# Altium schematic sheet Sheet1.SchDoc
size A1; SheetNumber: 1; SheetTotal: 1
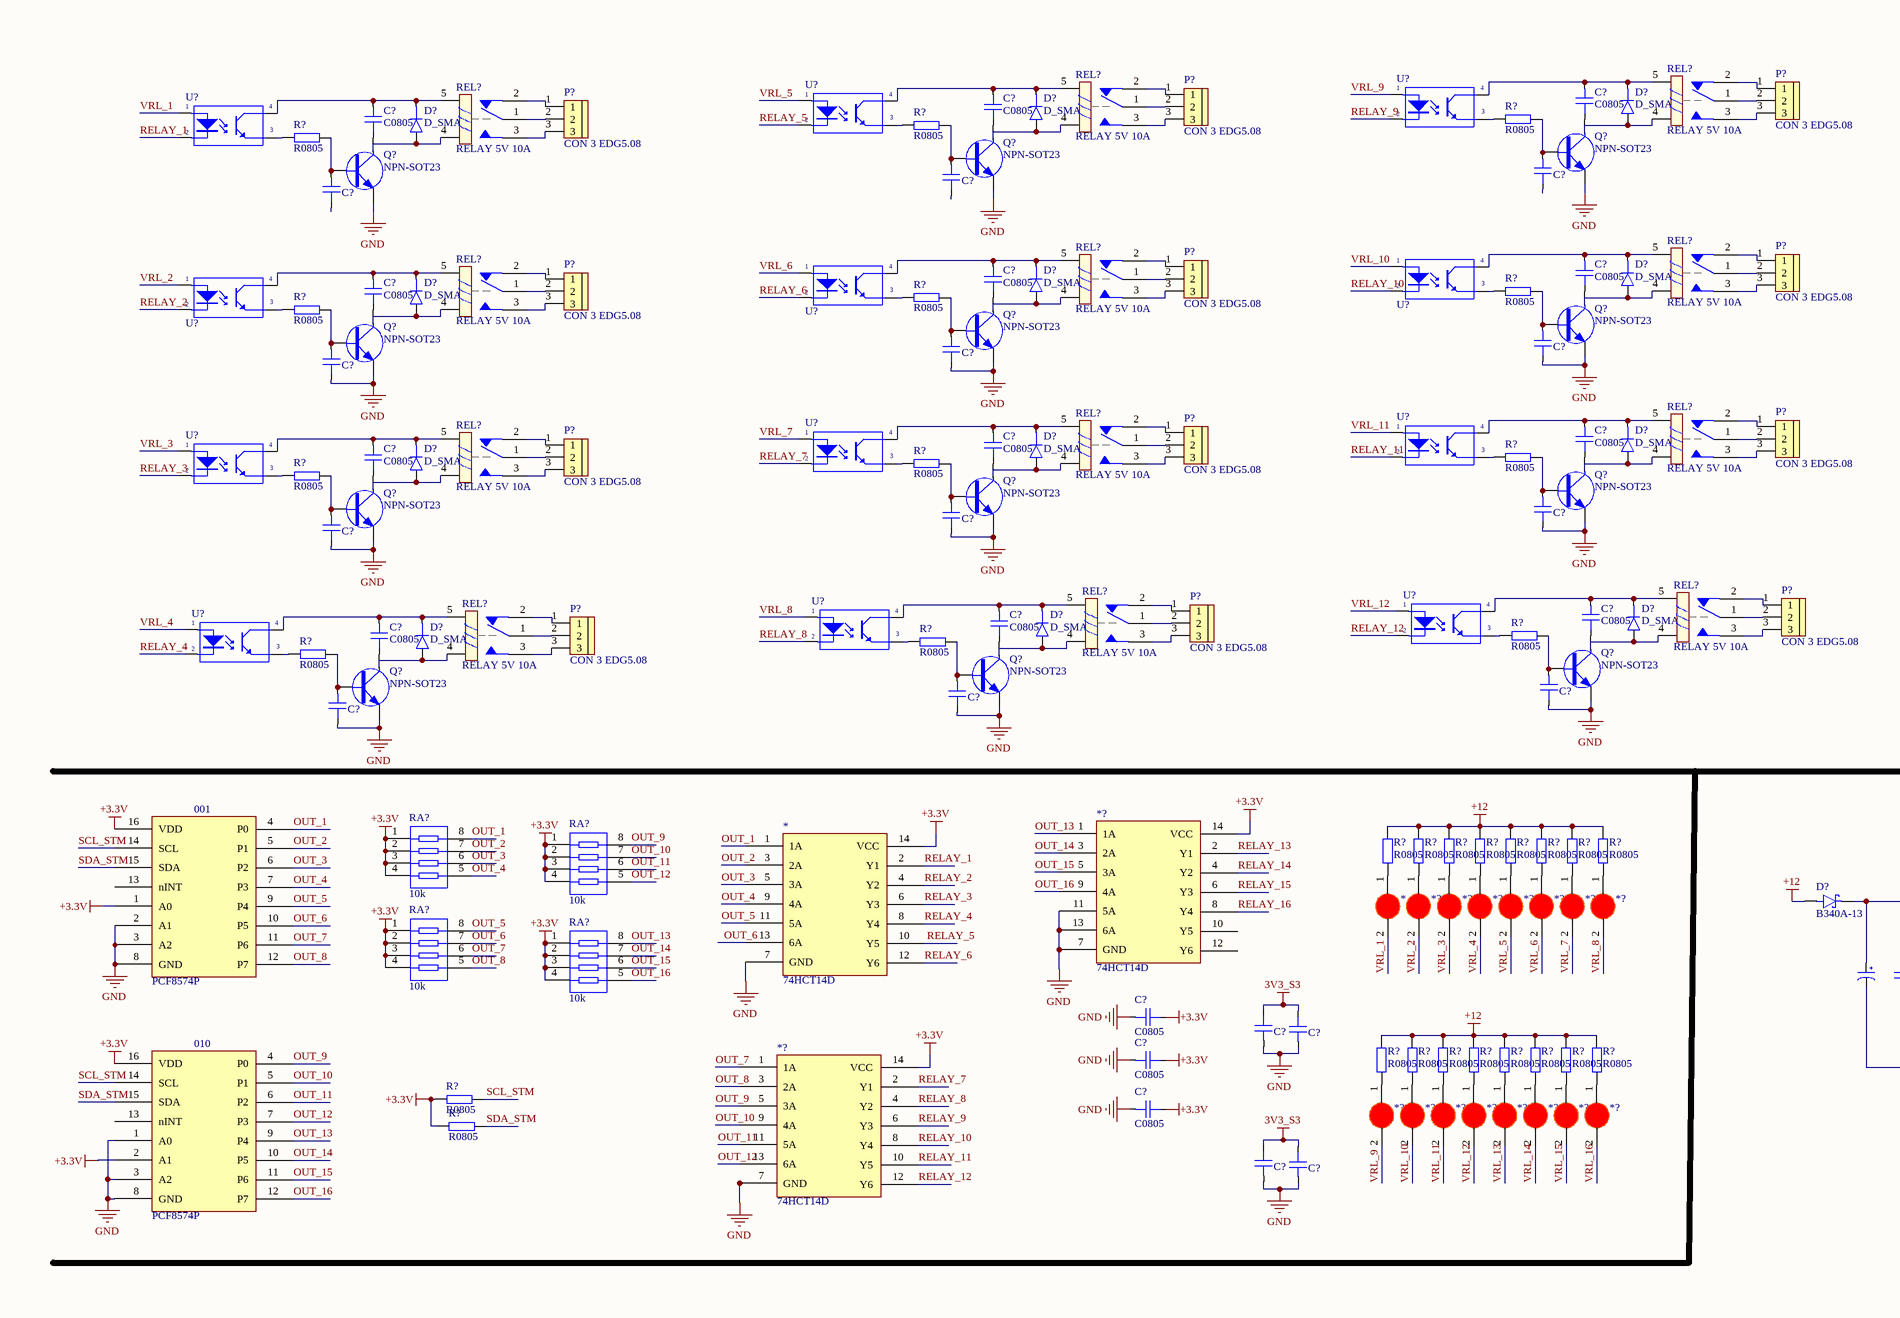
[diagram p0: Sheet1.SchDoc, top left]
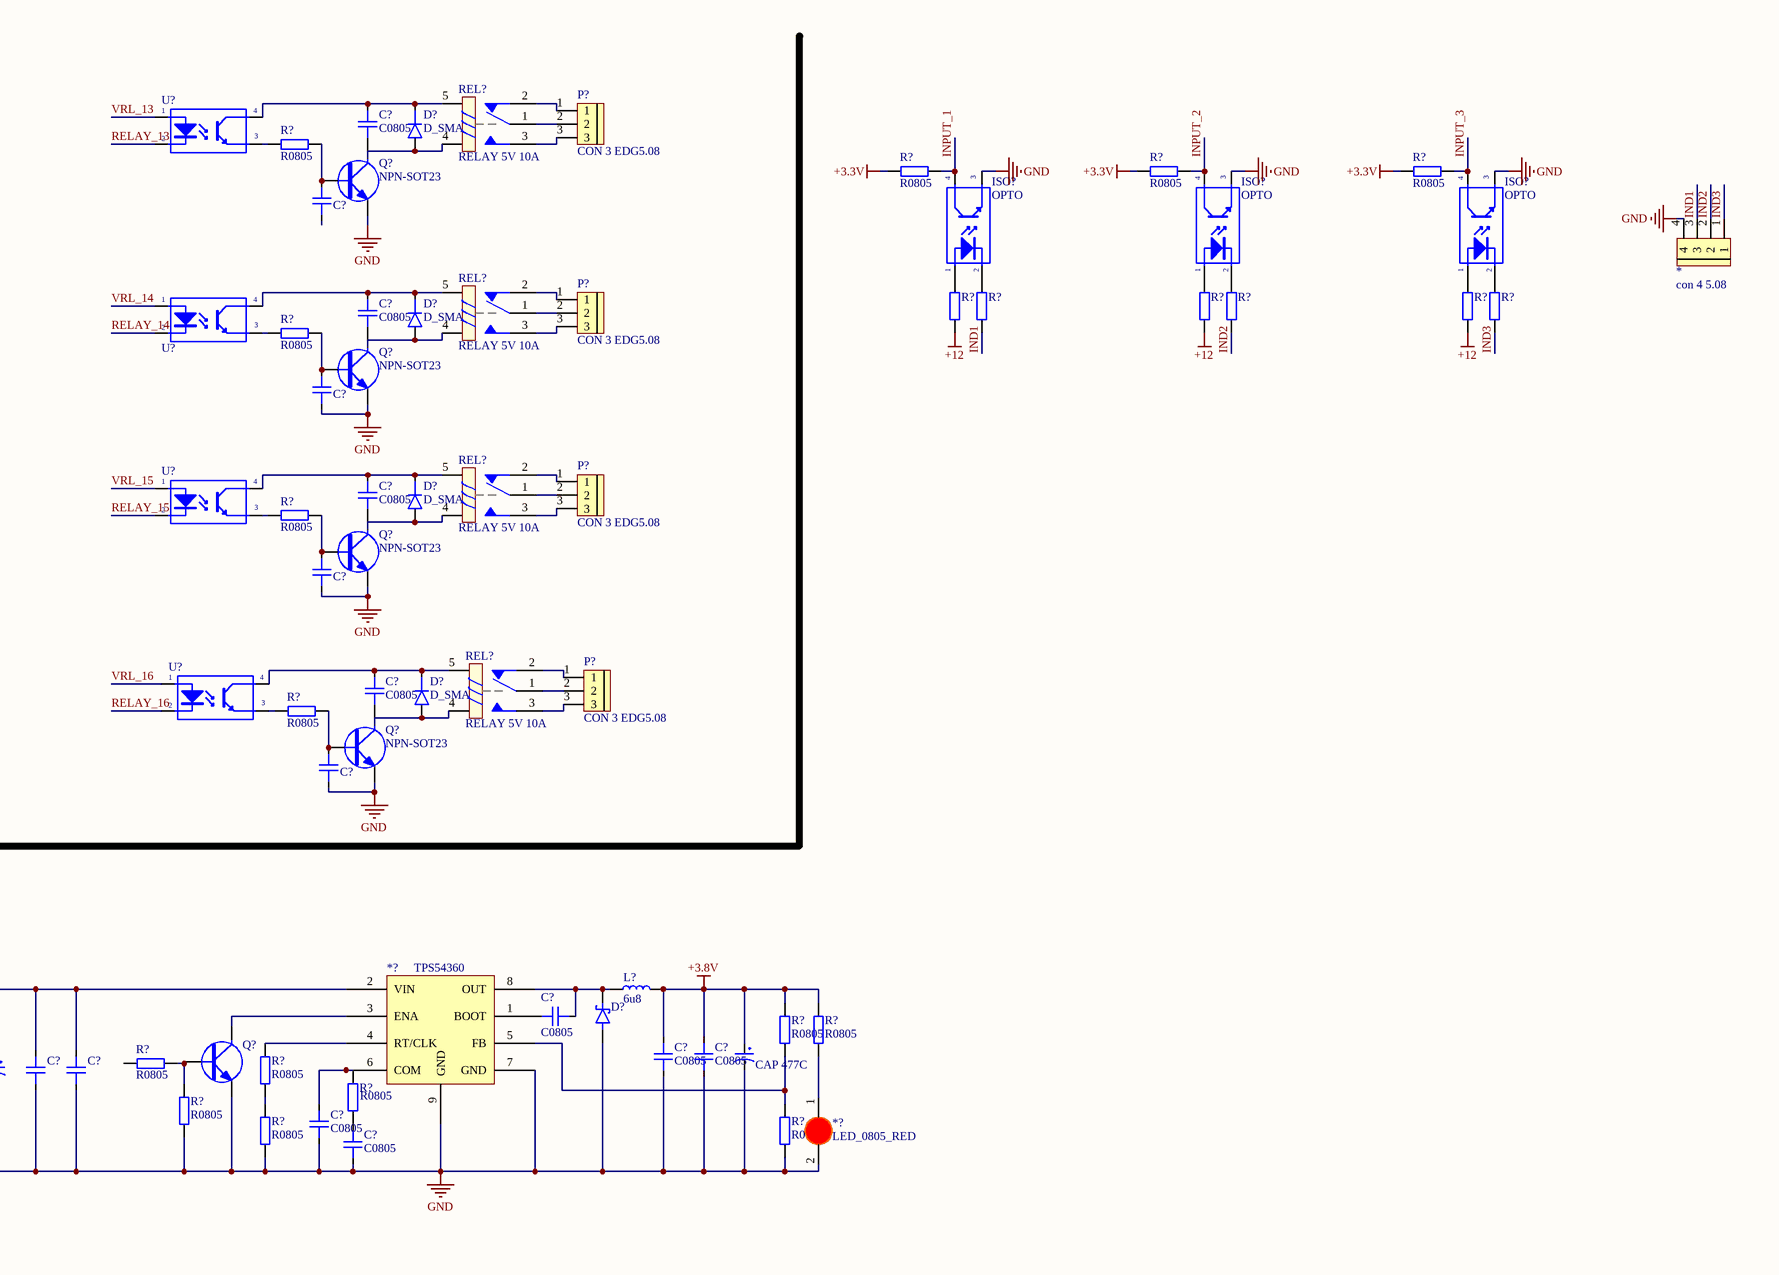
[diagram p1: Sheet1.SchDoc, top right]
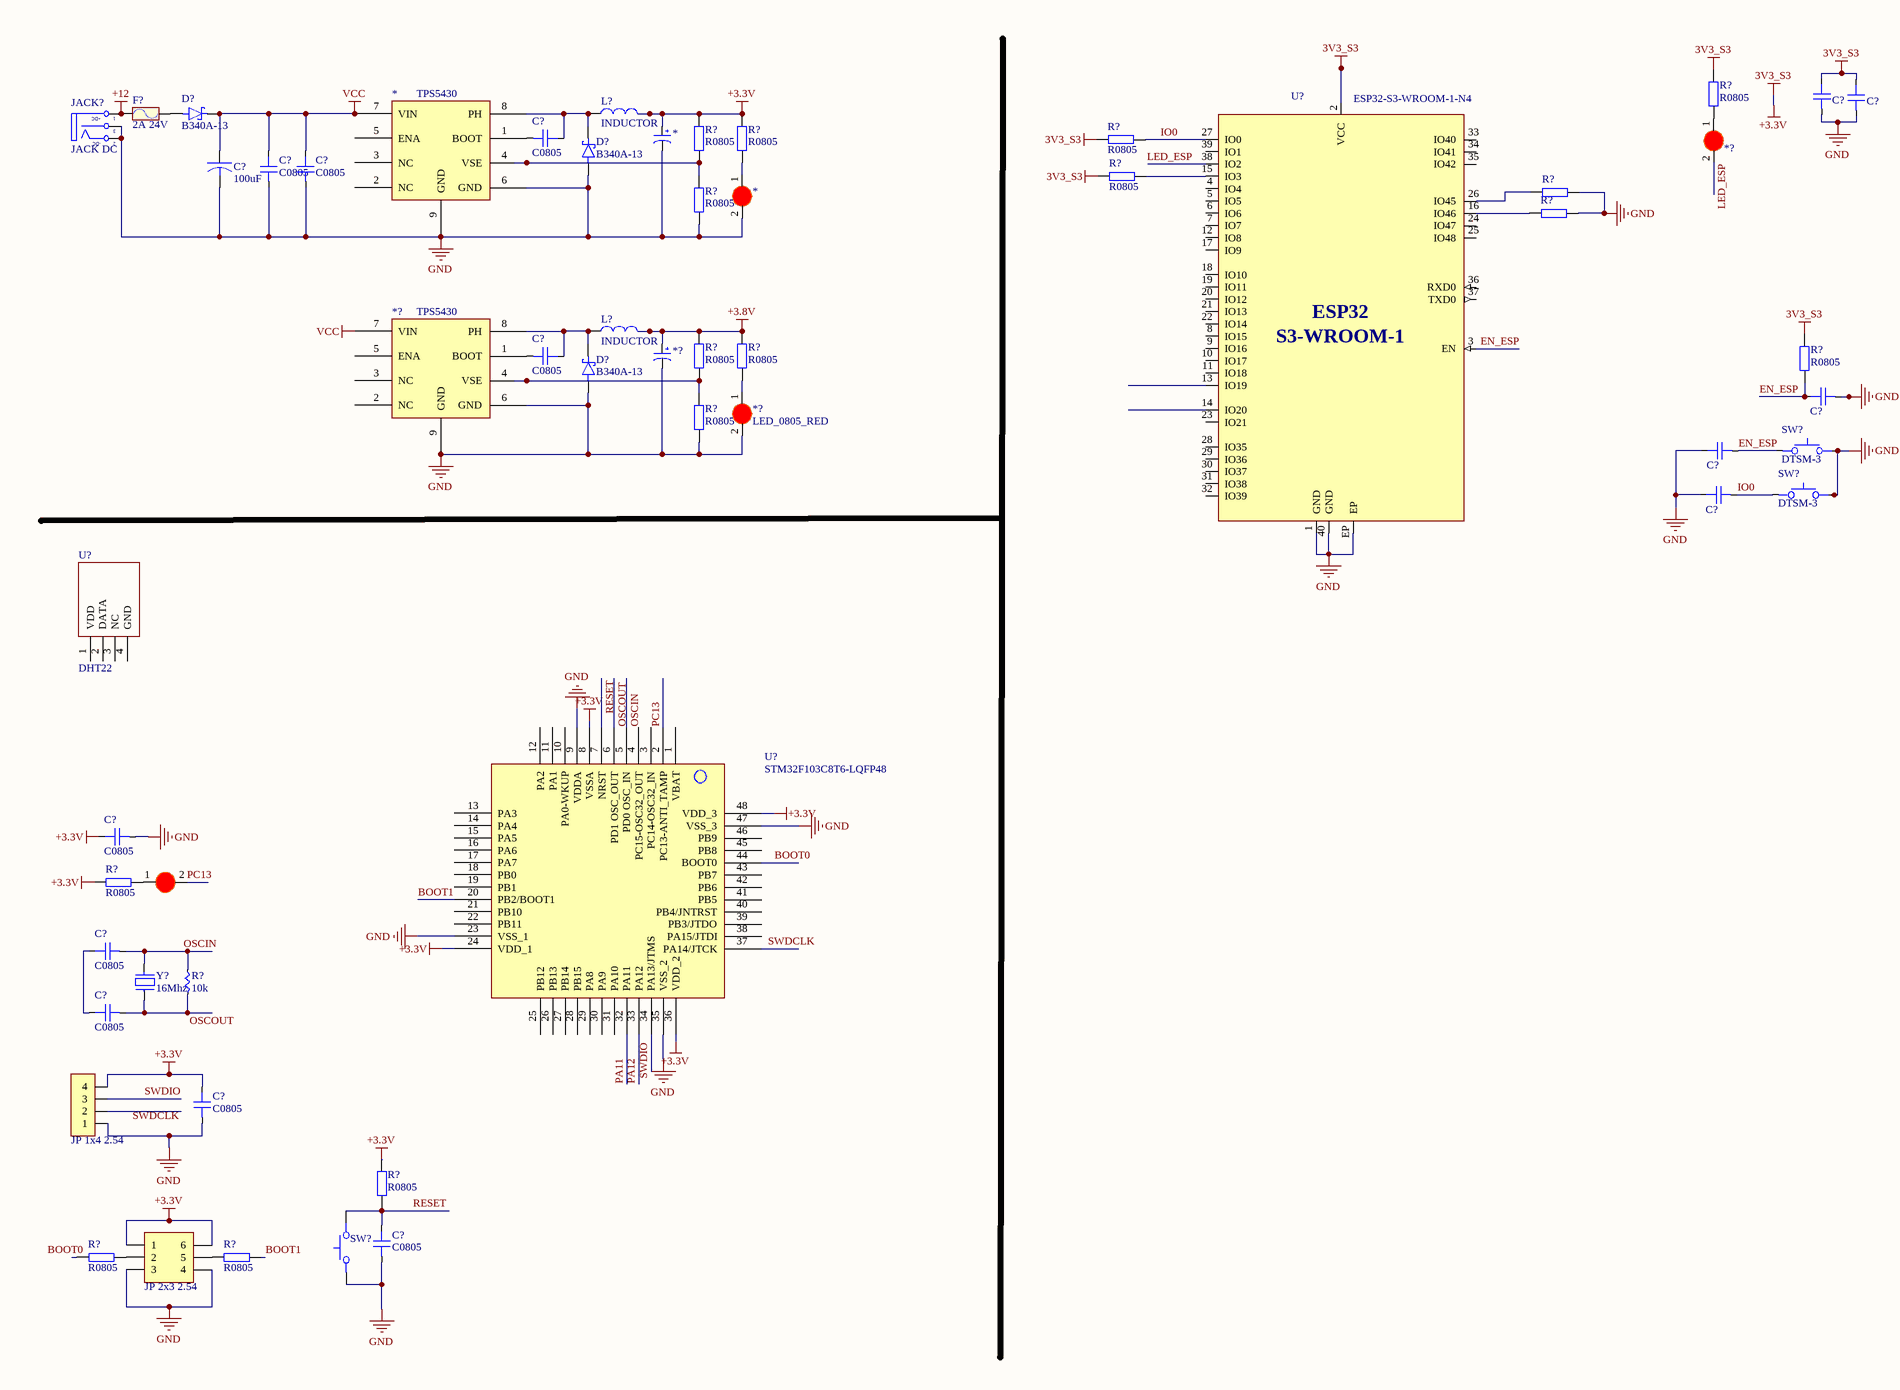
[diagram p2: Sheet1.SchDoc, bottom left]

## Parts
(Parts that share a designator on the sheet are numbered #1, #2 ... from top to bottom, then left to right.)
001  PCF8574P  [SOIC16 DW]
010  PCF8574P  [SOIC16 DW]
*#1  con 4 5.08  [Con 4 KF301 5.08]
*#2  74HCT14D  [SOIC 14PIN]
*#3  LED_0805_RED  [LED-0805-Red]  (value not drawn)
*#4  cap_tantan  [tu tantalum smd7343]  (value not drawn)
*#5  TPS5430  [TPS5430DDAR]
*#6  LED_0805_RED  [LED-0805-Red]  (value not drawn)
*?#1  74HCT14D  [SOIC 14PIN]
*?#2  LED_0805_RED  [LED-0805-Red]  (value not drawn)
*?#3  LED_0805_RED  [LED-0805-Red]  (value not drawn)
*?#4  LED_0805_RED  [LED-0805-Red]  (value not drawn)
*?#5  LED_0805_RED  [LED-0805-Red]  (value not drawn)
*?#6  LED_0805_RED  [LED-0805-Red]  (value not drawn)
*?#7  LED_0805_RED  [LED-0805-Red]  (value not drawn)
*?#8  LED_0805_RED  [LED-0805-Red]  (value not drawn)
*?#9  TPS54360  [TPS5430DDAR]
*?#10  74HCT14D  [SOIC 14PIN]
*?#11  LED_0805_RED  [LED-0805-Red]
*?#12  LED_0805_RED  [LED-0805-Red]  (value not drawn)
*?#13  LED_0805_RED  [LED-0805-Red]  (value not drawn)
*?#14  LED_0805_RED  [LED-0805-Red]  (value not drawn)
*?#15  LED_0805_RED  [LED-0805-Red]  (value not drawn)
*?#16  LED_0805_RED  [LED-0805-Red]  (value not drawn)
*?#17  LED_0805_RED  [LED-0805-Red]  (value not drawn)
*?#18  LED_0805_RED  [LED-0805-Red]  (value not drawn)
*?#19  LED_0805_RED  [LED-0805-Red]  (value not drawn)
*?#20  LED_0805_RED  [LED-0805-Red]  (value not drawn)
*?#21  cap_tantan  [tu tantalum smd7343]  (value not drawn)
*?#22  TPS5430  [TPS5430DDAR]
*?#23  LED_0805_RED  [LED-0805-Red]
*?#24  LED_0805_RED  [LED-0805-Red]  (value not drawn)
?  TỤ HÓA  [TU HOA 1000uF/25V,50V]  (value not drawn)
C?#1  C0805  [CAP_0805]
C?#2  C0805  [CAP_0805]
C?#3  C0805  [CAP_0805]
C?#4  C0805  [CAP_0805]
C?#5  C0805  [CAP_0805]  (value not drawn)
C?#6  C0805  [CAP_0805]  (value not drawn)
C?#7  C0805  [CAP_0805]  (value not drawn)
C?#8  C0805  [CAP_0805]  (value not drawn)
C?#9  C0805  [CAP_0805]
C?#10  C0805  [CAP_0805]
C?#11  C0805  [CAP_0805]
C?#12  C0805  [CAP_0805]
C?#13  C0805  [CAP_0805]  (value not drawn)
C?#14  C0805  [CAP_0805]  (value not drawn)
C?#15  C0805  [CAP_0805]  (value not drawn)
C?#16  C0805  [CAP_0805]  (value not drawn)
C?#17  C0805  [CAP_0805]
C?#18  C0805  [CAP_0805]
C?#19  C0805  [CAP_0805]
C?#20  C0805  [CAP_0805]
C?#21  C0805  [CAP_0805]  (value not drawn)
C?#22  C0805  [CAP_0805]  (value not drawn)
C?#23  C0805  [CAP_0805]  (value not drawn)
C?#24  C0805  [CAP_0805]  (value not drawn)
C?#25  C0805  [CAP_0805]
C?#26  C0805  [CAP_0805]
C?#27  C0805  [CAP_0805]
C?#28  C0805  [CAP_0805]
C?#29  C0805  [CAP_0805]  (value not drawn)
C?#30  C0805  [CAP_0805]  (value not drawn)
C?#31  C0805  [CAP_0805]  (value not drawn)
C?#32  C0805  [CAP_0805]  (value not drawn)
C?#33  C0805  [CAP_0805]
C?#34  C0805  [CAP_0805]
C?#35  C0805  [CAP_0805]
C?#36  C0805  [CAP_0805]  (value not drawn)
C?#37  C0805  [CAP_0805]  (value not drawn)
C?#38  C0805  [CAP_0805]
C?#39  C0805  [CAP_0805]
C?#40  C0805  [CAP_0805]  (value not drawn)
C?#41  C0805  [CAP_0805]  (value not drawn)
C?#42  C0805  [CAP_0805]
C?#43  C0805  [CAP_0805]
C?#44  C0805  [CAP_0805]
C?#45  C0805  [CAP_0805]  (value not drawn)
C?#46  C0805  [CAP_0805]  (value not drawn)
C?#47  C0805  [CAP_0805]  (value not drawn)
C?#48  C0805  [CAP_0805]  (value not drawn)
C?#49  C0805  [CAP_0805]
C?#50  100uF  [CAP ELECTROLITICO]
C?#51  C0805  [CAP_0805]
C?#52  C0805  [CAP_0805]
C?#53  C0805  [CAP_0805]
C?#54  C0805  [CAP_0805]  (value not drawn)
C?#55  C0805  [CAP_0805]  (value not drawn)
C?#56  C0805  [CAP_0805]  (value not drawn)
C?#57  C0805  [CAP_0805]
C?#58  C0805  [CAP_0805]
C?#59  C0805  [CAP_0805]
C?#60  C0805  [CAP_0805]
C?#61  C0805  [CAP_0805]
D?#1  D_SMA  [DO-214AC-2 (SMA)]
D?#2  D_SMA  [DO-214AC-2 (SMA)]
D?#3  D_SMA  [DO-214AC-2 (SMA)]
D?#4  D_SMA  [DO-214AC-2 (SMA)]
D?#5  D_SMA  [DO-214AC-2 (SMA)]
D?#6  D_SMA  [DO-214AC-2 (SMA)]
D?#7  D_SMA  [DO-214AC-2 (SMA)]
D?#8  D_SMA  [DO-214AC-2 (SMA)]
D?#9  D_SMA  [DO-214AC-2 (SMA)]
D?#10  D_SMA  [DO-214AC-2 (SMA)]
D?#11  D_SMA  [DO-214AC-2 (SMA)]
D?#12  D_SMA  [DO-214AC-2 (SMA)]
D?#13  D_SMA  [DO-214AC-2 (SMA)]
D?#14  D_SMA  [DO-214AC-2 (SMA)]
D?#15  D_SMA  [DO-214AC-2 (SMA)]
D?#16  D_SMA  [DO-214AC-2 (SMA)]
D?#17  B340A-13  [B340A]
D?#18  B340A-13  [B340A]  (value not drawn)
D?#19  B340A-13  [B340A]
D?#20  B340A-13  [B340A]
D?#21  B340A-13  [B340A]
F?  2A 24V  [Cau chi tu phuc hoi 2A 24V SMD1812]
ISO?#1  OPTO  [PC817 SMD]
ISO?#2  OPTO  [PC817 SMD]
ISO?#3  OPTO  [PC817 SMD]
JACK?  JACK DC  [JACK DC]
JP?#1  JP 1x4 2.54  [JP 1x4 DT]
JP?#2  JP 2x3 2.54  [JP 2x3 DT]
L?#1  6u8  [ASPI-0630HI-6R8M-T15]
L?#2  INDUCTOR  [Cuon Cam 12x12x10]
L?#3  INDUCTOR  [Cuon Cam 12x12x10]
P?#1  CON 3 EDG5.08  [CON 3P 5.08MM]
P?#2  CON 3 EDG5.08  [CON 3P 5.08MM]
P?#3  CON 3 EDG5.08  [CON 3P 5.08MM]
P?#4  CON 3 EDG5.08  [CON 3P 5.08MM]
P?#5  CON 3 EDG5.08  [CON 3P 5.08MM]
P?#6  CON 3 EDG5.08  [CON 3P 5.08MM]
P?#7  CON 3 EDG5.08  [CON 3P 5.08MM]
P?#8  CON 3 EDG5.08  [CON 3P 5.08MM]
P?#9  CON 3 EDG5.08  [CON 3P 5.08MM]
P?#10  CON 3 EDG5.08  [CON 3P 5.08MM]
P?#11  CON 3 EDG5.08  [CON 3P 5.08MM]
P?#12  CON 3 EDG5.08  [CON 3P 5.08MM]
P?#13  CON 3 EDG5.08  [CON 3P 5.08MM]
P?#14  CON 3 EDG5.08  [CON 3P 5.08MM]
P?#15  CON 3 EDG5.08  [CON 3P 5.08MM]
P?#16  CON 3 EDG5.08  [CON 3P 5.08MM]
Q?#1  NPN-SOT23  [SOT23 - 3PIN]
Q?#2  NPN-SOT23  [SOT23 - 3PIN]
Q?#3  NPN-SOT23  [SOT23 - 3PIN]
Q?#4  NPN-SOT23  [SOT23 - 3PIN]
Q?#5  NPN-SOT23  [SOT23 - 3PIN]
Q?#6  NPN-SOT23  [SOT23 - 3PIN]
Q?#7  NPN-SOT23  [SOT23 - 3PIN]
Q?#8  NPN-SOT23  [SOT23 - 3PIN]
Q?#9  NPN-SOT23  [SOT23 - 3PIN]
Q?#10  NPN-SOT23  [SOT23 - 3PIN]
Q?#11  NPN-SOT23  [SOT23 - 3PIN]
Q?#12  NPN-SOT23  [SOT23 - 3PIN]
Q?#13  NPN-SOT23  [SOT23 - 3PIN]
Q?#14  NPN-SOT23  [SOT23 - 3PIN]
Q?#15  NPN-SOT23  [SOT23 - 3PIN]
Q?#16  NPN-SOT23  [SOT23 - 3PIN]
Q?#17  NPN-SOT23  [SOT23 - 3PIN]  (value not drawn)
R?#1  R0805  [RES_0805]
R?#2  R0805  [RES_0805]
R?#3  R0805  [RES_0805]
R?#4  R0805  [RES_0805]
R?#5  R0805  [RES_0805]
R?#6  R0805  [RES_0805]
R?#7  R0805  [RES_0805]
R?#8  R0805  [RES_0805]  (value not drawn)
R?#9  R0805  [RES_0805]  (value not drawn)
R?#10  R0805  [RES_0805]  (value not drawn)
R?#11  R0805  [RES_0805]  (value not drawn)
R?#12  R0805  [RES_0805]  (value not drawn)
R?#13  R0805  [RES_0805]  (value not drawn)
R?#14  R0805  [RES_0805]
R?#15  R0805  [RES_0805]
R?#16  R0805  [RES_0805]
R?#17  R0805  [RES_0805]
R?#18  R0805  [RES_0805]
R?#19  R0805  [RES_0805]
R?#20  R0805  [RES_0805]
R?#21  R0805  [RES_0805]
R?#22  R0805  [RES_0805]
R?#23  R0805  [RES_0805]
R?#24  R0805  [RES_0805]
R?#25  R0805  [RES_0805]
R?#26  R0805  [RES_0805]
R?#27  R0805  [RES_0805]
R?#28  R0805  [RES_0805]
R?#29  R0805  [RES_0805]
R?#30  R0805  [RES_0805]
R?#31  R0805  [RES_0805]
R?#32  R0805  [RES_0805]
R?#33  R0805  [RES_0805]
R?#34  R0805  [RES_0805]
R?#35  R0805  [RES_0805]
R?#36  R0805  [RES_0805]
R?#37  R0805  [RES_0805]
R?#38  R0805  [RES_0805]
R?#39  R0805  [RES_0805]
R?#40  R0805  [RES_0805]
R?#41  R0805  [RES_0805]
R?#42  R0805  [RES_0805]
R?#43  R0805  [RES_0805]
R?#44  R0805  [RES_0805]
R?#45  R0805  [RES_0805]
R?#46  R0805  [RES_0805]
R?#47  R0805  [RES_0805]
R?#48  R0805  [RES_0805]
R?#49  R0805  [RES_0805]
R?#50  R0805  [RES_0805]
R?#51  R0805  [RES_0805]
R?#52  R0805  [RES_0805]
R?#53  R0805  [RES_0805]
R?#54  R0805  [RES_0805]
R?#55  R0805  [RES_0805]
R?#56  R0805  [RES_0805]
R?#57  R0805  [RES_0805]  (value not drawn)
R?#58  R0805  [RES_0805]
R?#59  R0805  [RES_0805]  (value not drawn)
R?#60  R0805  [RES_0805]
R?#61  R0805  [RES_0805]
R?#62  R0805  [RES_0805]
R?#63  R0805  [RES_0805]
R?#64  R0805  [RES_0805]
R?#65  10k  [RES 0805]
R?#66  R0805  [RES_0805]
R?#67  R0805  [RES_0805]
R?#68  R0805  [RES_0805]
RA?#1  10k  [RES 0603x4]
RA?#2  10k  [RES 0603x4]
RA?#3  10k  [RES 0603x4]
RA?#4  10k  [RES 0603x4]
REL?#1  RELAY 5V 10A  [RELAY 5V-10A]
REL?#2  RELAY 5V 10A  [RELAY 5V-10A]
REL?#3  RELAY 5V 10A  [RELAY 5V-10A]
REL?#4  RELAY 5V 10A  [RELAY 5V-10A]
REL?#5  RELAY 5V 10A  [RELAY 5V-10A]
REL?#6  RELAY 5V 10A  [RELAY 5V-10A]
REL?#7  RELAY 5V 10A  [RELAY 5V-10A]
REL?#8  RELAY 5V 10A  [RELAY 5V-10A]
REL?#9  RELAY 5V 10A  [RELAY 5V-10A]
REL?#10  RELAY 5V 10A  [RELAY 5V-10A]
REL?#11  RELAY 5V 10A  [RELAY 5V-10A]
REL?#12  RELAY 5V 10A  [RELAY 5V-10A]
REL?#13  RELAY 5V 10A  [RELAY 5V-10A]
REL?#14  RELAY 5V 10A  [RELAY 5V-10A]
REL?#15  RELAY 5V 10A  [RELAY 5V-10A]
REL?#16  RELAY 5V 10A  [RELAY 5V-10A]
SW?#1  DTSM-3  [DTSM-3]
SW?#2  DTSM-3  [DTSM-3]
SW?#3  DTSM-3  [DTSM-3]  (value not drawn)
Tụ_tantalum_?  CAP 477C  [tu tantalum smd7343]
U?#1  OPTO PC817 SMD  [PC817 SMD]  (value not drawn)
U?#2  OPTO PC817 SMD  [PC817 SMD]  (value not drawn)
U?#3  OPTO PC817 SMD  [PC817 SMD]  (value not drawn)
U?#4  OPTO PC817 SMD  [PC817 SMD]  (value not drawn)
U?#5  OPTO PC817 SMD  [PC817 SMD]  (value not drawn)
U?#6  OPTO PC817 SMD  [PC817 SMD]  (value not drawn)
U?#7  OPTO PC817 SMD  [PC817 SMD]  (value not drawn)
U?#8  OPTO PC817 SMD  [PC817 SMD]  (value not drawn)
U?#9  OPTO PC817 SMD  [PC817 SMD]  (value not drawn)
U?#10  OPTO PC817 SMD  [PC817 SMD]  (value not drawn)
U?#11  OPTO PC817 SMD  [PC817 SMD]  (value not drawn)
U?#12  OPTO PC817 SMD  [PC817 SMD]  (value not drawn)
U?#13  OPTO PC817 SMD  [PC817 SMD]  (value not drawn)
U?#14  OPTO PC817 SMD  [PC817 SMD]  (value not drawn)
U?#15  OPTO PC817 SMD  [PC817 SMD]  (value not drawn)
U?#16  OPTO PC817 SMD  [PC817 SMD]  (value not drawn)
U?#17  ESP32-S3-WROOM-1-N4  [ESP32-S3-WROOM-1]
U?#18  DHT22  [DHT22]
U?#19  STM32F103C8T6-LQFP48  [LQFP 48 PIN]
Y?  16Mhz  [Thach Anh 2 chan cam]

## Nets
+3.3V: 001.1(A0) 001.16(VDD) 010.2(A1) 010.16(VDD) *#2.14(VCC) *#4.1 *?#1.14(VCC) *?#10.14(VCC) C?#38.2 C?#40.2 C?#41.2 C?#43.2 C?#44.2 C?#45.2 C?#46.2 C?#47.2 C?#48.2 C?#57.2 C?#60.2 JP?#1.4 JP?#2.1 JP?#2.6 L?#2.2 R?#5.2 R?#6.2 R?#7.2 R?#50.1 R?#51.1 R?#52.2 R?#53.2 R?#54.2 R?#55.2 R?#56.2 R?#62.2 R?#64.2 R?#66.2 RA?#1.1 RA?#1.2 RA?#1.3 RA?#1.4 RA?#2.1 RA?#2.2 RA?#2.3 RA?#2.4 RA?#3.1 RA?#3.2 RA?#3.3 RA?#3.4 RA?#4.1 RA?#4.2 RA?#4.3 RA?#4.4 U?#17.2(VCC) U?#19.8(VSSA) U?#19.24(VDD_1) U?#19.36(VDD_2) U?#19.48(VDD_3)  [also labelled 3V3_S3]
+3.8V: *?#21.1 C?#34.1 C?#35.1 L?#1.2 L?#3.2 R?#34.2 R?#35.2 R?#60.2 R?#61.2 Tụ_tantalum_?.1
+12: D?#17.A F?.1 JACK?.1(T) R?#8.2 R?#10.2 R?#12.2 R?#26.2 R?#27.2 R?#28.2 R?#29.2 R?#30.2 R?#31.2 R?#32.2 R?#33.2 R?#42.2 R?#43.2 R?#44.2 R?#45.2 R?#46.2 R?#47.2 R?#48.2 R?#49.2
GND: 001.2(A1) 001.3(A2) 001.8(GND) 010.1(A0) 010.3(A2) 010.8(GND) *#1.4 *#2.7(GND) *#4.2 *#5.6(GND) *#5.9(GND) *#6.2(K) *?#1.7(GND) *?#1.11(5A) *?#1.13(6A) *?#9.7(GND) *?#9.9(GND) *?#10.7(GND) *?#11.2(K) *?#21.2 *?#22.6(GND) *?#22.9(GND) *?#23.2(K) ?.2 C?#13.2 C?#14.2 C?#15.2 C?#16.2 C?#21.2 C?#22.2 C?#23.2 C?#24.2 C?#29.2 C?#30.2 C?#31.2 C?#32.2 C?#34.2 C?#35.2 C?#36.1 C?#37.1 C?#38.1 C?#39.1 C?#40.1 C?#41.1 C?#42.1 C?#43.1 C?#44.1 C?#45.1 C?#46.1 C?#47.1 C?#48.1 C?#50.2 C?#51.1 C?#52.1 C?#54.1 C?#55.2 C?#56.2 C?#57.1 C?#60.1 C?#61.1 D?#18.A D?#20.A D?#21.A ISO?#1.3(E) ISO?#2.3(E) ISO?#3.3(E) JACK?.2(TN) JACK?.3(S) JP?#1.1 JP?#2.3 JP?#2.4 Q?#1.2(E) Q?#2.2(E) Q?#3.2(E) Q?#4.2(E) Q?#5.2(E) Q?#6.2(E) Q?#7.2(E) Q?#8.2(E) Q?#9.2(E) Q?#10.2(E) Q?#11.2(E) Q?#12.2(E) Q?#13.2(E) Q?#14.2(E) Q?#15.2(E) Q?#16.2(E) Q?#17.2(E) R?#39.1 R?#40.1 R?#41.1 R?#57.1 R?#58.1 R?#59.1 R?#63.1 SW?#1.2 SW?#2.2 SW?#3.1 Tụ_tantalum_?.2 U?#17.1(GND) U?#17.40(GND) U?#17.EP U?#19.9(VDDA) U?#19.23(VSS_1) U?#19.35(VSS_2) U?#19.47(VSS_3)
VCC: *#5.7(VIN) *?#22.7(VIN) C?#50.1 C?#51.2 C?#52.2 D?#19.C
BOOT0: U?#19.44(BOOT0)
BOOT1: R?#68.1 U?#19.20(PB2/BOOT1)
EN_ESP: C?#54.2 C?#55.1 R?#62.1 SW?#1.1 U?#17.3(EN)
IND1: *#1.3 R?#9.2
IND2: *#1.2 R?#11.2
IND3: *#1.1 R?#13.2
INPUT_1: ISO?#1.4(C) R?#5.1
INPUT_2: ISO?#2.4(C) R?#6.1
INPUT_3: ISO?#3.4(C) R?#7.1
IO0: C?#56.1 R?#55.1 SW?#2.1 U?#17.27(IO0)
LED_ESP: *?#20.2(K)
OSCIN: U?#19.5(PD0_OSC_IN)
OSCOUT: C?#59.1 R?#65.2 U?#19.6(PD1_OSC_OUT) Y?.1
OUT_1: 001.4(P0) *#2.1(1A) RA?#1.8
OUT_2: 001.5(P1) *#2.3(2A) RA?#1.7
OUT_3: 001.6(P2) *#2.5(3A) RA?#1.6
OUT_4: 001.7(P3) *#2.9(4A) RA?#1.5
OUT_5: 001.9(P4) *#2.11(5A) RA?#3.8
OUT_6: 001.10(P5) *#2.13(6A) RA?#3.7
OUT_7: 001.11(P6) *?#10.1(1A) RA?#3.6
OUT_8: 001.12(P7) *?#10.3(2A) RA?#3.5
OUT_9: 010.4(P0) *?#10.5(3A) RA?#2.8
OUT_10: 010.5(P1) *?#10.9(4A) RA?#2.7
OUT_11: 010.6(P2) *?#10.11(5A) RA?#2.6
OUT_12: 010.7(P3) *?#10.13(6A) RA?#2.5
OUT_13: 010.9(P4) *?#1.1(1A) RA?#4.8
OUT_14: 010.10(P5) *?#1.3(2A) RA?#4.7
OUT_15: 010.11(P6) *?#1.5(3A) RA?#4.6
OUT_16: 010.12(P7) *?#1.9(4A) RA?#4.5
PA11: U?#19.32(PA11)
PA12: U?#19.33(PA12)
PC13: *?#24.2(K) U?#19.2(PC13-ANTI_TAMP)
RELAY_1: *#2.2(Y1) U?#4.2(K)
RELAY_2: *#2.4(Y2) U?#8.2(K)
RELAY_3: *#2.6(Y3) U?#12.2(K)
RELAY_4: *#2.8(Y4) U?#16.2(K)
RELAY_5: *#2.10(Y5) U?#2.2(K)
RELAY_6: *#2.12(Y6) U?#6.2(K)
RELAY_7: *?#10.2(Y1) U?#10.2(K)
RELAY_8: *?#10.4(Y2) U?#14.2(K)
RELAY_9: *?#10.6(Y3) U?#1.2(K)
RELAY_10: *?#10.8(Y4) U?#5.2(K)
RELAY_11: *?#10.10(Y5) U?#9.2(K)
RELAY_12: *?#10.12(Y6) U?#13.2(K)
RELAY_13: *?#1.2(Y1) U?#3.2(K)
RELAY_14: *?#1.4(Y2) U?#7.2(K)
RELAY_15: *?#1.6(Y3) U?#11.2(K)
RELAY_16: *?#1.8(Y4) U?#15.2(K)
RESET: C?#61.2 R?#66.1 SW?#3.2 U?#19.7(NRST)
SCL_STM: 001.14(SCL) 010.14(SCL) R?#50.2
SDA_STM: 001.15(SDA) 010.15(SDA) R?#51.2
SWDCLK: U?#19.37(PA14/JTCK)
SWDIO: JP?#1.3 U?#19.34(PA13/JTMS)
VRL_1: *#3.2(K) U?#4.1(A)
VRL_2: *?#2.2(K) U?#8.1(A)
VRL_3: *?#3.2(K) U?#12.1(A)
VRL_4: *?#4.2(K) U?#16.1(A)
VRL_5: *?#5.2(K) U?#2.1(A)
VRL_6: *?#6.2(K) U?#6.1(A)
VRL_7: *?#7.2(K) U?#10.1(A)
VRL_8: *?#8.2(K) U?#14.1(A)
VRL_9: *?#12.2(K) U?#1.1(A)
VRL_10: *?#13.2(K) U?#5.1(A)
VRL_11: *?#14.2(K) U?#9.1(A)
VRL_12: *?#15.2(K) U?#13.1(A)
VRL_13: *?#16.2(K) U?#3.1(A)
VRL_14: *?#17.2(K) U?#7.1(A)
VRL_15: *?#18.2(K) U?#11.1(A)
VRL_16: *?#19.2(K) U?#15.1(A)
Net*#3_1: *#3.1(A) R?#26.1
Net*#5_1: *#5.1(BOOT) C?#49.1
Net*#5_4: *#5.4(VSE) R?#53.1 R?#58.2
Net*#5_8: *#5.8(PH) C?#49.2 D?#20.C L?#2.1
Net*#6_1: *#6.1(A) R?#54.1
Net*?#2_1: *?#2.1(A) R?#27.1
Net*?#3_1: *?#3.1(A) R?#28.1
Net*?#4_1: *?#4.1(A) R?#29.1
Net*?#5_1: *?#5.1(A) R?#30.1
Net*?#6_1: *?#6.1(A) R?#31.1
Net*?#7_1: *?#7.1(A) R?#32.1
Net*?#8_1: *?#8.1(A) R?#33.1
Net*?#9_1: *?#9.1(BOOT) C?#33.2
Net*?#9_2: *?#9.2(VIN) ?.1 C?#36.2 C?#37.2 D?#17.C
Net*?#9_3: *?#9.3(ENA) Q?#17.3(C)
Net*?#9_4: *?#9.4(RT/CLK) R?#37.2
Net*?#9_5: *?#9.5(FB) R?#34.1 R?#41.2
Net*?#9_6: *?#9.6(COM) C?#39.2 R?#38.2
Net*?#9_8: *?#9.8(OUT) C?#33.1 D?#18.C L?#1.1
Net*?#11_1: *?#11.1(A) R?#35.1
Net*?#12_1: *?#12.1(A) R?#42.1
Net*?#13_1: *?#13.1(A) R?#43.1
Net*?#14_1: *?#14.1(A) R?#44.1
Net*?#15_1: *?#15.1(A) R?#45.1
Net*?#16_1: *?#16.1(A) R?#46.1
Net*?#17_1: *?#17.1(A) R?#47.1
Net*?#18_1: *?#18.1(A) R?#48.1
Net*?#19_1: *?#19.1(A) R?#49.1
Net*?#20_1: *?#20.1(A) R?#52.1
Net*?#22_1: *?#22.1(BOOT) C?#53.1
Net*?#22_4: *?#22.4(VSE) R?#60.1 R?#63.2
Net*?#22_8: *?#22.8(PH) C?#53.2 D?#21.C L?#3.1
Net*?#23_1: *?#23.1(A) R?#61.1
Net*?#24_1: *?#24.1(A) R?#64.1
NetC?#1_1: C?#1.1 D?#1.K REL?#1.5 U?#1.4(C)
NetC?#1_2: C?#1.2 Q?#1.3(C)
NetC?#2_1: C?#2.1 D?#2.K REL?#2.5 U?#2.4(C)
NetC?#2_2: C?#2.2 Q?#2.3(C)
NetC?#3_1: C?#3.1 D?#3.K REL?#3.5 U?#3.4(C)
NetC?#3_2: C?#3.2 Q?#3.3(C)
NetC?#4_1: C?#4.1 D?#4.K REL?#4.5 U?#4.4(C)
NetC?#4_2: C?#4.2 Q?#4.3(C)
NetC?#5_1: C?#5.1 Q?#1.1(B) R?#1.1
NetC?#6_1: C?#6.1 Q?#2.1(B) R?#2.1
NetC?#7_1: C?#7.1 Q?#3.1(B) R?#3.1
NetC?#8_1: C?#8.1 Q?#4.1(B) R?#4.1
NetC?#9_1: C?#9.1 D?#5.K REL?#5.5 U?#5.4(C)
NetC?#9_2: C?#9.2 Q?#5.3(C)
NetC?#10_1: C?#10.1 D?#6.K REL?#6.5 U?#6.4(C)
NetC?#10_2: C?#10.2 Q?#6.3(C)
NetC?#11_1: C?#11.1 D?#7.K REL?#7.5 U?#7.4(C)
NetC?#11_2: C?#11.2 Q?#7.3(C)
NetC?#12_1: C?#12.1 D?#8.K REL?#8.5 U?#8.4(C)
NetC?#12_2: C?#12.2 Q?#8.3(C)
NetC?#13_1: C?#13.1 Q?#5.1(B) R?#14.1
NetC?#14_1: C?#14.1 Q?#6.1(B) R?#15.1
NetC?#15_1: C?#15.1 Q?#7.1(B) R?#16.1
NetC?#16_1: C?#16.1 Q?#8.1(B) R?#17.1
NetC?#17_1: C?#17.1 D?#9.K REL?#9.5 U?#9.4(C)
NetC?#17_2: C?#17.2 Q?#9.3(C)
NetC?#18_1: C?#18.1 D?#10.K REL?#10.5 U?#10.4(C)
NetC?#18_2: C?#18.2 Q?#10.3(C)
NetC?#19_1: C?#19.1 D?#11.K REL?#11.5 U?#11.4(C)
NetC?#19_2: C?#19.2 Q?#11.3(C)
NetC?#20_1: C?#20.1 D?#12.K REL?#12.5 U?#12.4(C)
NetC?#20_2: C?#20.2 Q?#12.3(C)
NetC?#21_1: C?#21.1 Q?#9.1(B) R?#18.1
NetC?#22_1: C?#22.1 Q?#10.1(B) R?#19.1
NetC?#23_1: C?#23.1 Q?#11.1(B) R?#20.1
NetC?#24_1: C?#24.1 Q?#12.1(B) R?#21.1
NetC?#25_1: C?#25.1 D?#13.K REL?#13.5 U?#13.4(C)
NetC?#25_2: C?#25.2 Q?#13.3(C)
NetC?#26_1: C?#26.1 D?#14.K REL?#14.5 U?#14.4(C)
NetC?#26_2: C?#26.2 Q?#14.3(C)
NetC?#27_1: C?#27.1 D?#15.K REL?#15.5 U?#15.4(C)
NetC?#27_2: C?#27.2 Q?#15.3(C)
NetC?#28_1: C?#28.1 D?#16.K REL?#16.5 U?#16.4(C)
NetC?#28_2: C?#28.2 Q?#16.3(C)
NetC?#29_1: C?#29.1 Q?#13.1(B) R?#22.1
NetC?#30_1: C?#30.1 Q?#14.1(B) R?#23.1
NetC?#31_1: C?#31.1 Q?#15.1(B) R?#24.1
NetC?#32_1: C?#32.1 Q?#16.1(B) R?#25.1
NetC?#42_2: C?#42.2 R?#38.1
NetC?#58_1: C?#58.1 R?#65.1 Y?.2
NetC?#58_2: C?#58.2 C?#59.2
NetD?#1_A: D?#1.A REL?#1.4
NetD?#2_A: D?#2.A REL?#2.4
NetD?#3_A: D?#3.A REL?#3.4
NetD?#4_A: D?#4.A REL?#4.4
NetD?#5_A: D?#5.A REL?#5.4
NetD?#6_A: D?#6.A REL?#6.4
NetD?#7_A: D?#7.A REL?#7.4
NetD?#8_A: D?#8.A REL?#8.4
NetD?#9_A: D?#9.A REL?#9.4
NetD?#10_A: D?#10.A REL?#10.4
NetD?#11_A: D?#11.A REL?#11.4
NetD?#12_A: D?#12.A REL?#12.4
NetD?#13_A: D?#13.A REL?#13.4
NetD?#14_A: D?#14.A REL?#14.4
NetD?#15_A: D?#15.A REL?#15.4
NetD?#16_A: D?#16.A REL?#16.4
NetD?#19_A: D?#19.A F?.2
NetISO?#1_1: ISO?#1.1(A) R?#8.1
NetISO?#1_2: ISO?#1.2(K) R?#9.1
NetISO?#2_1: ISO?#2.1(A) R?#10.1
NetISO?#2_2: ISO?#2.2(K) R?#11.1
NetISO?#3_1: ISO?#3.1(A) R?#12.1
NetISO?#3_2: ISO?#3.2(K) R?#13.1
NetJP?#2_2: JP?#2.2 R?#67.1
NetJP?#2_5: JP?#2.5 R?#68.2
NetP?#1_1: P?#1.1 REL?#1.2
NetP?#1_2: P?#1.2 REL?#1.1
NetP?#1_3: P?#1.3 REL?#1.3
NetP?#2_1: P?#2.1 REL?#2.2
NetP?#2_2: P?#2.2 REL?#2.1
NetP?#2_3: P?#2.3 REL?#2.3
NetP?#3_1: P?#3.1 REL?#3.2
NetP?#3_2: P?#3.2 REL?#3.1
NetP?#3_3: P?#3.3 REL?#3.3
NetP?#4_1: P?#4.1 REL?#4.2
NetP?#4_2: P?#4.2 REL?#4.1
NetP?#4_3: P?#4.3 REL?#4.3
NetP?#5_1: P?#5.1 REL?#5.2
NetP?#5_2: P?#5.2 REL?#5.1
NetP?#5_3: P?#5.3 REL?#5.3
NetP?#6_1: P?#6.1 REL?#6.2
NetP?#6_2: P?#6.2 REL?#6.1
NetP?#6_3: P?#6.3 REL?#6.3
NetP?#7_1: P?#7.1 REL?#7.2
NetP?#7_2: P?#7.2 REL?#7.1
NetP?#7_3: P?#7.3 REL?#7.3
NetP?#8_1: P?#8.1 REL?#8.2
NetP?#8_2: P?#8.2 REL?#8.1
NetP?#8_3: P?#8.3 REL?#8.3
NetP?#9_1: P?#9.1 REL?#9.2
NetP?#9_2: P?#9.2 REL?#9.1
NetP?#9_3: P?#9.3 REL?#9.3
NetP?#10_1: P?#10.1 REL?#10.2
NetP?#10_2: P?#10.2 REL?#10.1
NetP?#10_3: P?#10.3 REL?#10.3
NetP?#11_1: P?#11.1 REL?#11.2
NetP?#11_2: P?#11.2 REL?#11.1
NetP?#11_3: P?#11.3 REL?#11.3
NetP?#12_1: P?#12.1 REL?#12.2
NetP?#12_2: P?#12.2 REL?#12.1
NetP?#12_3: P?#12.3 REL?#12.3
NetP?#13_1: P?#13.1 REL?#13.2
NetP?#13_2: P?#13.2 REL?#13.1
NetP?#13_3: P?#13.3 REL?#13.3
NetP?#14_1: P?#14.1 REL?#14.2
NetP?#14_2: P?#14.2 REL?#14.1
NetP?#14_3: P?#14.3 REL?#14.3
NetP?#15_1: P?#15.1 REL?#15.2
NetP?#15_2: P?#15.2 REL?#15.1
NetP?#15_3: P?#15.3 REL?#15.3
NetP?#16_1: P?#16.1 REL?#16.2
NetP?#16_2: P?#16.2 REL?#16.1
NetP?#16_3: P?#16.3 REL?#16.3
NetQ?#17_1: Q?#17.1(B) R?#36.2 R?#39.2
NetR?#1_2: R?#1.2 U?#1.3(E)
NetR?#2_2: R?#2.2 U?#2.3(E)
NetR?#3_2: R?#3.2 U?#3.3(E)
NetR?#4_2: R?#4.2 U?#4.3(E)
NetR?#14_2: R?#14.2 U?#5.3(E)
NetR?#15_2: R?#15.2 U?#6.3(E)
NetR?#16_2: R?#16.2 U?#7.3(E)
NetR?#17_2: R?#17.2 U?#8.3(E)
NetR?#18_2: R?#18.2 U?#9.3(E)
NetR?#19_2: R?#19.2 U?#10.3(E)
NetR?#20_2: R?#20.2 U?#11.3(E)
NetR?#21_2: R?#21.2 U?#12.3(E)
NetR?#22_2: R?#22.2 U?#13.3(E)
NetR?#23_2: R?#23.2 U?#14.3(E)
NetR?#24_2: R?#24.2 U?#15.3(E)
NetR?#25_2: R?#25.2 U?#16.3(E)
NetR?#37_1: R?#37.1 R?#40.2
NetR?#56_1: R?#56.1 U?#17.15(IO3)
NetR?#57_2: R?#57.2 U?#17.26(IO45)
NetR?#59_2: R?#59.2 U?#17.16(IO46)

Not connected (* = marked no-connect by the designer): 001 13(nINT); 010 13(nINT); *#5 2(NC) 3(NC) 5(ENA); *?#1 10(Y5) 12(Y6); *?#22 2(NC) 3(NC) 5(ENA); C?#5 2; C?#6 2; C?#7 2; C?#8 2; JP?#1 2; R?#36 1; R?#67 2; U?#17 4(IO4) 5(IO5) 6(IO6) 7(IO7) 8(IO15) 9(IO16) 10(IO17) 11(IO18) 12(IO8) 13(IO19) 14(IO20) 17(IO9) 18(IO10) 19(IO11) 20(IO12) 21(IO13) 22(IO14) 23(IO21) 24(IO47) 25(IO48) 28(IO35) 29(IO36) 30(IO37) 31(IO38) 32(IO39) 33(IO40) 34(IO41) 35(IO42) 36(RXD0) 37(TXD0) 38(IO2) 39(IO1); U?#18 1(VDD) 2(DATA) 3(NC) 4(GND); U?#19 1(VBAT) 3(PC14-OSC32_IN) 4(PC15-OSC32_OUT) 10(PA0-WKUP) 11(PA1) 12(PA2) 13(PA3) 14(PA4) 15(PA5) 16(PA6) 17(PA7) 18(PB0) 19(PB1) 21(PB10) 22(PB11) 25(PB12) 26(PB13) 27(PB14) 28(PB15) 29(PA8) 30(PA9) 31(PA10) 38(PA15/JTDI) 39(PB3/JTDO) 40(PB4/JNTRST) 41(PB5) 42(PB6) 43(PB7) 45(PB8) 46(PB9)

## Notes on the sheet
- Labels drawn without touching a wire or pin: BOOT0, LED_ESP, OSCIN, SWDCLK
- (in symbol ESP32-S3-WROOM-1-N4) ESP32; S3-WROOM-1
- (in symbol JACK DC) +DC; -DC

## Library data of the parts
001 = PCF8574P: 001
? = TỤ HÓA: 1000uF/50V
C?#1-C?#49 C?#51-C?#61 = CAP_0805: Capacitor SMD 0805; Manufacturer: *; Manufacturer Part Number: *; Distributor Link: *; LCSC: *; Rating: *; Dielectric: *
C?#50 = CAPACITOR
D?#1-D?#16 = D_SMA: Diode SMD SMA (DO-214AA)
D?#17-D?#21 = B340A-13: Diode Schottky 40 V 3A Surface Mount SMA; MF: Diodes Inc.; Value: *; MP: B340A-13; Package: DO-214 Diodes Inc.; Availability: In Stock; Price: None; SnapEDA_Link: https://www.snapeda.com/parts/B340A-13/Diodes+Inc./view-part/?ref=snap; Check_prices: https://www.snapeda.com/parts/B340A-13/Diodes+Inc./view-part/?ref=eda; Purchase-URL: https://pricing.snapeda.com/search/part/B340A-13/?ref=eda
F? = Fuse self-recovering: 2A 24V SMD1812; Ma_Hang: MH010033; Ten: Cầu Chì Tự Phục Hồi 2A 24V SMD1812
ISO?#1-ISO?#3 = OPTO: Value: TLP5211
JACK? = JACK DC: Value: Jac DC
JP?#1 = JP 1x4 2.54 Duc Thang: Cắm; Ten_Linh_Kien: Jump Đơn Đực 2.54MM 1x40P Thẳng 11MM; Don_Vi: Con; Ma_Hang: MH000903; Ghi_Chu: *; Kieu_Chan: *; Chung_Loai: Cắm
JP?#2 = JP 2x3 2.54 Duc Thang: Cắm; Ten_Linh_Kien: Jump Đôi Đực 2.54MM 2x40P Thẳng 11MM; Don_Vi: Con; Ma_Hang: MH002686; Ghi_Chu: *; Kieu_Chan: *; Chung_Loai: Cắm
L?#1 = ASPI-0630HI-6R8M-T15: Inductor SMD 6.8uH 20% 8A Shielded; Manufacturer: ABRACON; Manufacturer Part Number: ASPI-0630HI-6R8M-T15
P?#1-P?#16 = CON 3 EDG5.08: Cắm; Ten_Linh_Kien: CON 3 2EDG5.08-3P 5.08MM ( Xanh Cong); Ma_Hang: MH000760; Ghi_Chu: *; Kieu_Chan: *; Don_Vi: Con; Chung_Loai: Cắm
R?#1-R?#64 R?#66-R?#68 = RES_0805: Resistor SMD 0805; Manufacturer: *; Manufacturer Part Number: *; Distributor Link: *; LCSC: *
R?#65 = RES 0805: RES SMD 0805; Manufacturer: Vishay Dale; Manufacturer Part Number: CRCW040210K0FKED; Tolerance: ±1%; Power (Watts): 0.063W, 1/16W; Temperature Coefficient: ±100ppm/°C; Supplier 1: Digi-Key; RoHS: RoHS Compliant; Category: Resistors; Stock 1: 2392462; Pricing 1: 10=0.083, 50=0.0444, 200=0.0255, 1000=0.0174 (USD); Packaging: Cut Tape (CT); Resistance (Ohms): 10k; Composition: Thick Film; Features: Automotive AEC-Q200; Operating Temperature: -55°C ~ 155°C; Package / Case: 0402 (1005 Metric); Supplier Device Package: 0402 (1005 Metric); Size / Dimension: 0.039" L x 0.020" W (1.00mm x 0.50mm); Height: 0.016" (0.40mm); Number of Terminations: 2; ComponentLink1URL: http://www.vishay.com/docs/20035/dcrcwe3.pdf; ComponentLink1Description: http://www.vishay.com/docs/20035/dcrcwe3.pdf; Supplier Part Number 1: 541-10.0KLCT-ND
RA?#1-RA?#4 = RES 0603x4
SW?#1-SW?#3 = DTSM-3: Tactile Switch SMD SPST; Manufacturer: Diptronics; Manufacturer Part Number: DTSM-3
Tụ_tantalum_? = CAP 477C: Tụ tantalum 7343 477C 16V 470uF 7.3x4.3mm
U?#1-U?#16 = OPTO PC817 SMD: Single Opto; Value: PC817
U?#17 = ESP32-S3-WROOM-1-N4: 2.4 GHz Wi-Fi (802.11 b/g/n) and Bluetooth 5 (LE) Module ESP32-S3, 4MB Flash, on-board PCB antenna); Manufacturer: Espressif; Manufacturer Part Number: ESP32-S3-WROOM-1-N4; Distributor Link: https://www.mouser.de/ProductDetail/Espressif-Systems/ESP32-S3-WROOM-1-N4?qs=Li%252BoUPsLEnsO%2FkiJOUK0FQ%3D%3D
Y? = XTAL: Crystal For all Crystal 2pin.; Value: 4Mhz
U?#19 = STM32F103C8T6-LQFP48: Published: 30-May-2008; DatasheetVersion: rev6, Mar-2008; PackageVersion: Mar-2008; PackageReference: LQFP48; Publisher: Altium Limited; PackageDescription: 48-Pin Low-Profile Quad Flat Pack, 7 x 7 mm Body, 0.5 mm Pitch (LQFP48); ComponentLink1Description: Manufacturer Link; ComponentLink1URL: www.st.com/stm32; ComponentLink2Description: Datasheet; ComponentLink2URL: http://www.st.com/stonline/products/literature/ds/13586.pdf